# EAGLE design mrShark LED-Marker (EAGLE 7.2.0)
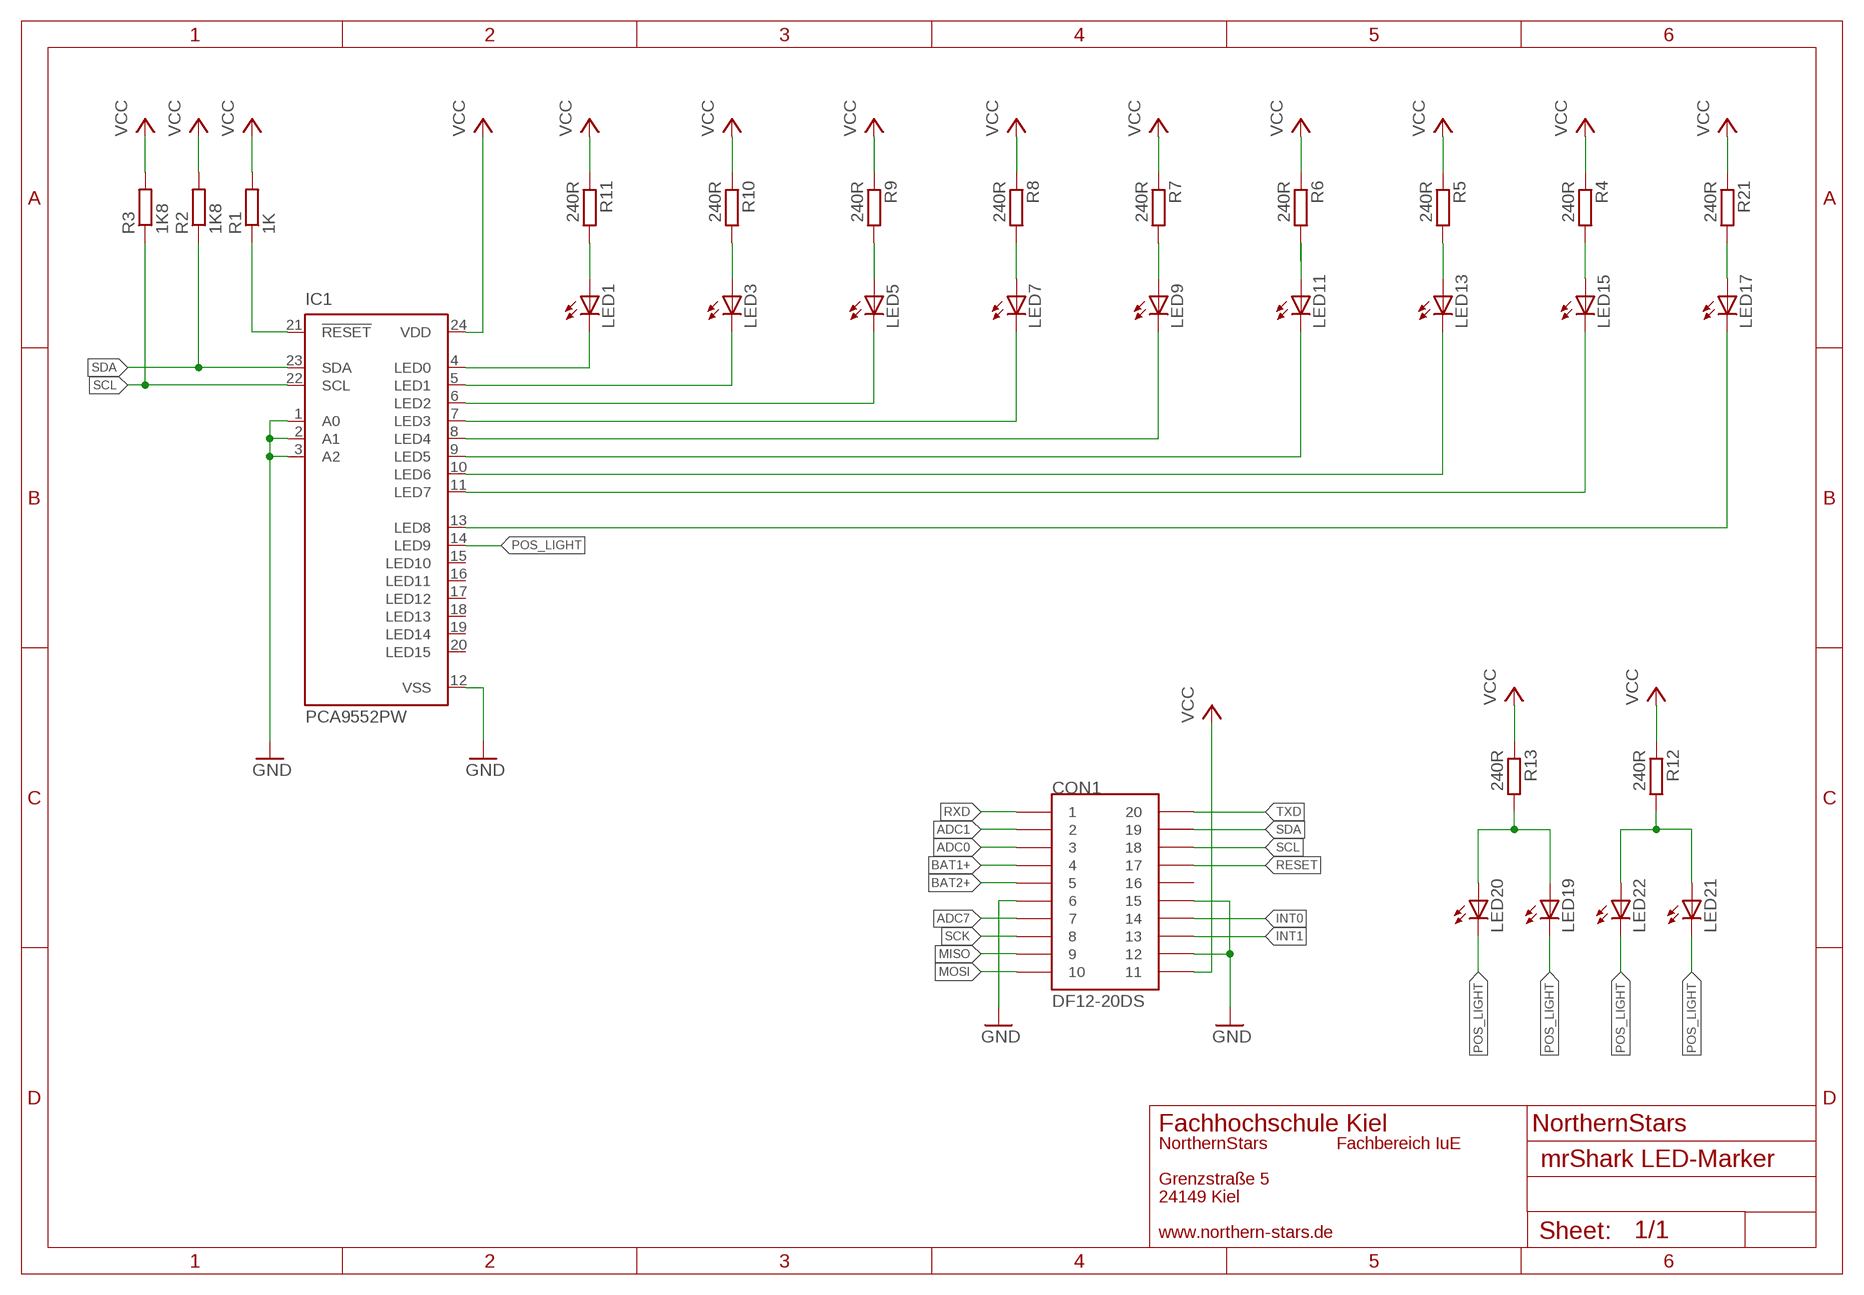
[diagram p0: schematic, sheet 1]

## Parts
CON1  DF12-20DS  [DF12-20DS]
IC1  PCA9552PW  [TSSOP24]
LED1  LEDCHIPLED_0603  [CHIPLED_0603]
LED3  LEDCHIPLED_0603  [CHIPLED_0603]
LED5  LEDCHIPLED_0603  [CHIPLED_0603]
LED7  LEDCHIPLED_0603  [CHIPLED_0603]
LED9  LEDCHIPLED_0603  [CHIPLED_0603]
LED11  LEDCHIPLED_0603  [CHIPLED_0603]
LED13  LEDCHIPLED_0603  [CHIPLED_0603]
LED15  LEDCHIPLED_0603  [CHIPLED_0603]
LED17  LEDCHIPLED_0603  [CHIPLED_0603]
LED19  LEDCHIPLED_0603  [CHIPLED_0603]
LED20  LEDCHIPLED_0603  [CHIPLED_0603]
LED21  LEDCHIPLED_0603  [CHIPLED_0603]
LED22  LEDCHIPLED_0603  [CHIPLED_0603]
R1  1K  R-EU_R0603  [R0603]
R2  1K8  R-EU_R0603  [R0603]
R3  1K8  R-EU_R0603  [R0603]
R4  240R  R-EU_R0603  [R0603]
R5  240R  R-EU_R0603  [R0603]
R6  240R  R-EU_R0603  [R0603]
R7  240R  R-EU_R0603  [R0603]
R8  240R  R-EU_R0603  [R0603]
R9  240R  R-EU_R0603  [R0603]
R10  240R  R-EU_R0603  [R0603]
R11  240R  R-EU_R0603  [R0603]
R12  240R  R-EU_R0603  [R0603]
R13  240R  R-EU_R0603  [R0603]
R21  240R  R-EU_R0603  [R0603]

## Nets
ADC0: CON1.3
ADC1: CON1.2
ADC7: CON1.7
BAT1+: CON1.4
BAT2+: CON1.5
GND: CON1.6 CON1.12 CON1.15 IC1.1(A0) IC1.2(A1) IC1.3(A2) IC1.12(VSS)
INT0: CON1.14
INT1: CON1.13
MISO: CON1.9
MOSI: CON1.10
N$1: IC1.21(!RESET) R1.1
N$2: LED17.A R21.2
N$3: LED21.A LED22.A R12.2
N$4: LED15.A R4.2
N$5: LED13.A R5.2
N$6: LED11.A R6.2
N$7: LED9.A R7.2
N$8: LED7.A R8.2
N$9: LED19.A LED20.A R13.2
N$10: LED5.A R9.2
N$11: LED3.A R10.2
N$12: LED1.A R11.2
N$13: IC1.4(LED0) LED1.C
N$14: IC1.5(LED1) LED3.C
N$15: IC1.6(LED2) LED5.C
N$16: IC1.7(LED3) LED7.C
N$17: IC1.8(LED4) LED9.C
N$18: IC1.9(LED5) LED11.C
N$19: IC1.10(LED6) LED13.C
N$20: IC1.11(LED7) LED15.C
N$21: IC1.13(LED8) LED17.C
POS_LIGHT: IC1.14(LED9) LED19.C LED20.C LED21.C LED22.C
RESET: CON1.17
RXD: CON1.1
SCK: CON1.8
SCL: CON1.18 IC1.22(SCL) R3.1
SDA: CON1.19 IC1.23(SDA) R2.1
TXD: CON1.20
VCC: CON1.11 IC1.24(VDD) R1.2 R2.2 R3.2 R4.1 R5.1 R6.1 R7.1 R8.1 R9.1 R10.1 R11.1 R12.1 R13.1 R21.1
Unconnected: CON1.16 IC1.15(LED10) IC1.16(LED11) IC1.17(LED12) IC1.18(LED13) IC1.19(LED14) IC1.20(LED15)

## Notes on the sheet
- Fachhochschule Kiel | NorthernStars
- NorthernStars | Fachbereich IuE
- Grenzstraße 5
- 24149 Kiel
- www.northern-stars.de

## Library data of the parts
CON1 = con-hirose:DF12-20: HRS-Hirose DF12-Series 0.5mm Pitch SMT Board to Board Connector 20 contacts
IC1 = micro-philips:PCA9552: 16-bit I 2 C-bus LED driver with programmable blink rates
LED1 LED3 LED5 LED7 LED9 LED11 LED13 LED15 LED17 LED19-LED22 = led:LED: LED OSRAM: - CHIPLED LG R971, LG N971, LY N971, LG Q971, LY Q971, LO R971, LY R971 LH N974, LH R974 LS Q976, LO Q976, LY Q976 LO Q996 - Hyper CHIPLED LW Q18S LB Q993, LB Q99A, LB R99A - SideLED LS A670, LO A670, LY A670, LG A670, LP A670 LB A673, LV A673, LT A673, LW A673 LH A674 LY A675 LS A676, LA A676, LO A676, LY A676, LW A676 LS A679, LY A679, LG A679 - Hyper Micro SIDELED® LS Y876, LA Y876, LO Y876, LY Y876 LT Y87S - SmartLED LW L88C, LW L88S LB L89C, LB L89S, LG L890 LS L89K, LO L89K, LY L89K LS L896, LA L896, LO L896, LY L896 - TOPLED LS T670, LO T670, LY T670, LG T670, LP T670 LSG T670, LSP T670, LSY T670, LOP T670, LYG T670 LG T671, LOG T671, LSG T671 LB T673, LV T673, LT T673, LW T673 LH T674 LS T676, LA T676, LO T676, LY T676, LB T676, LH T676, LSB T676, LW T676 LB T67C, LV T67C, LT T67C, LS T67K, LO T67K, LY T67K, LW E67C LS E67B, LA E67B, LO E67B, LY E67B, LB E67C, LV E67C, LT E67C LW T67C LS T679, LY T679, LG T679 LS T770, LO T770, LY T770, LG T770, LP T770 LB T773, LV T773, LT T773, LW T773 LH T774 LS E675, LA E675, LY E675, LS T675 LS T776, LA T776, LO T776, LY T776, LB T776 LHGB T686 LT T68C, LB T68C - Hyper Mini TOPLED® LB M676 - Mini TOPLED Santana® LG M470 LS M47K, LO M47K, LY M47K Source: http://www.osram.convergy.de LUXEON: - LUMILED® LXK2-PW12-R00, LXK2-PW12-S00, LXK2-PW14-U00, LXK2-PW14-V00 LXK2-PM12-R00, LXK2-PM12-S00, LXK2-PM14-U00 LXK2-PE12-Q00, LXK2-PE12-R00, LXK2-PE12-S00, LXK2-PE14-T00, LXK2-PE14-U00 LXK2-PB12-K00, LXK2-PB12-L00, LXK2-PB12-M00, LXK2-PB14-N00, LXK2-PB14-P00, LXK2-PB14-Q00 LXK2-PR12-L00, LXK2-PR12-M00, LXK2-PR14-Q00, LXK2-PR14-R00 LXK2-PD12-Q00, LXK2-PD12-R00, LXK2-PD12-S00 LXK2-PH12-R00, LXK2-PH12-S00 LXK2-PL12-P00, LXK2-PL12-Q00, LXK2-PL12-R00 Source: www.luxeon.com KINGBRIGHT: KA-3528ASYC Source: www.kingbright.com
R1-R13 R21 = rcl:R-EU_: RESISTOR, European symbol

## Board
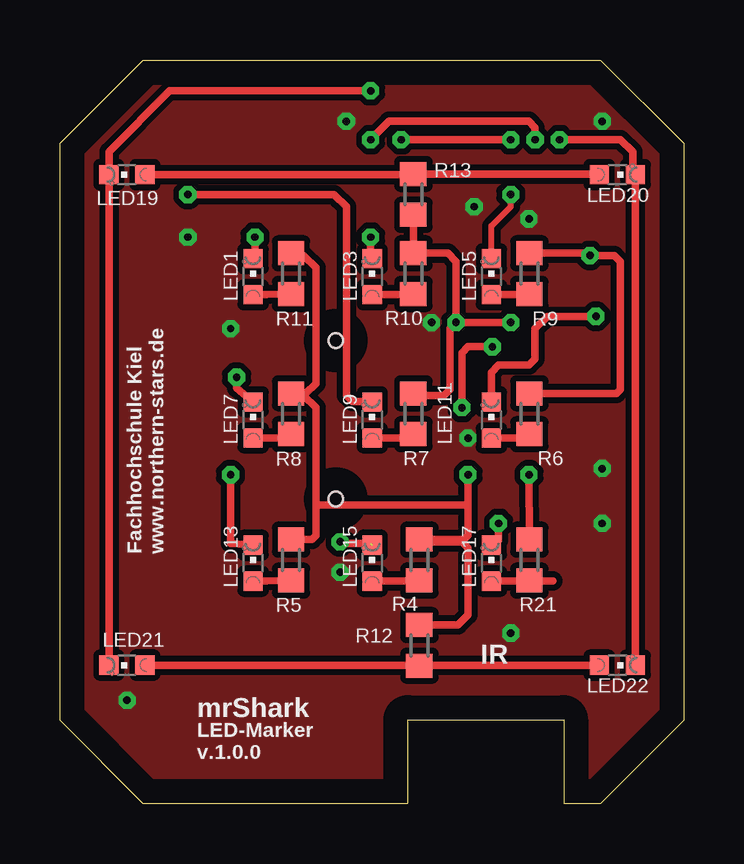
[diagram p1: board, top side]
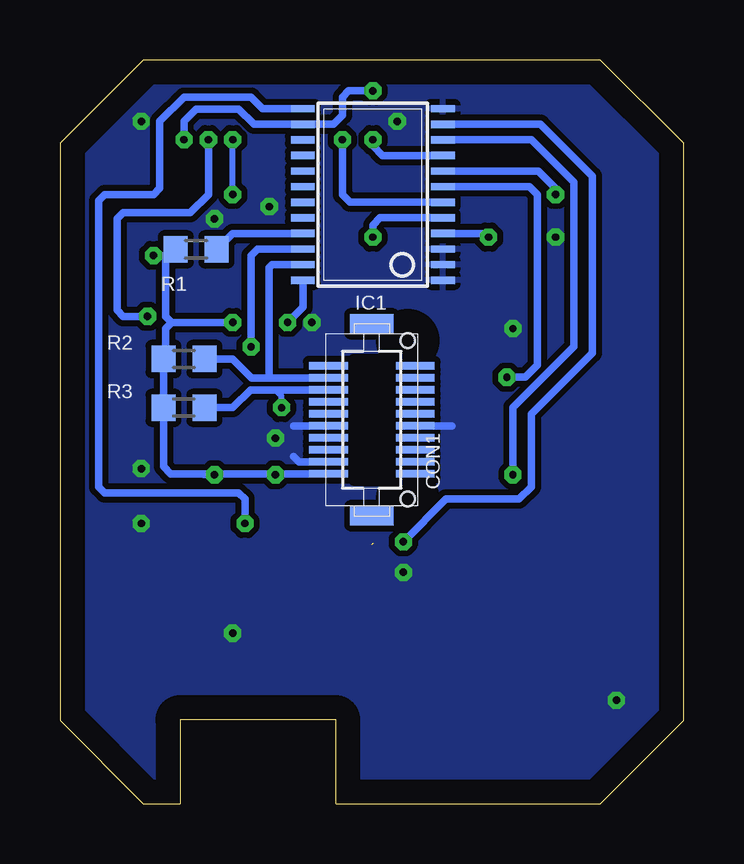
[diagram p2: board, bottom side, seen from below]

Size 26 x 31 mm. Coordinates in mm from the lower left corner, seen from the top.
Outline: 0,27.53 3.47,31 22.53,31 26,27.53 26,3.47 22.53,0 21,0 21,3.5 14.5,3.5 14.5,0 3.47,0 0,3.47 0,27.53
Copper layers (1*16): Top 0.035mm / dielectric 1.5mm / Bottom 0.035mm
Design rules "default": minimum track width 10mil, minimum drill 24mil, track to track 8mil, track to pad 8mil, pad to pad 8mil, via to via 8mil, smd to smd 8mil, copper to edge 40mil, drill to drill 8mil, minimum pad ring 10mil, minimum via ring 8mil, stop-mask expansion 4mil, vias tented up to drill 0mil, thermal gap 10mil

### Footprints (pad centres in the part's own frame; a part is rotated, then mirrored left to right if it is on the bottom)
DF12-20DS = smd 0.32 x 1.62: 1 -2.25,1.81; 2 -1.75,1.81; 3 -1.25,1.81; 4 -0.75,1.81; 5 -0.25,1.81; 6 0.25,1.81; 7 0.75,1.81; 8 1.25,1.81; 9 1.75,1.81; 10 2.25,1.81; 11 2.25,-1.81; 12 1.75,-1.81; 13 1.25,-1.81; 14 0.75,-1.81; 15 0.25,-1.81; 16 -0.25,-1.81; 17 -0.75,-1.81; 18 -1.25,-1.81; 19 -1.75,-1.81; 20 -2.25,-1.81 | smd 0.8 x 1.8: T1 -4,0; T2 4,0 | hole 0.6: -3.3,1.5; 3.3,1.5
TSSOP24 = smd 0.305 x 0.991: 1 -3.575,-2.918; 2 -2.925,-2.918; 3 -2.275,-2.918; 4 -1.625,-2.918; 5 -0.975,-2.918; 6 -0.325,-2.918; 7 0.325,-2.918; 8 0.975,-2.918; 9 1.625,-2.918; 10 2.275,-2.918; 11 2.925,-2.918; 12 3.575,-2.918; 13 3.575,2.918; 14 2.925,2.918; 15 2.275,2.918; 16 1.625,2.918; 17 0.975,2.918; 18 0.325,2.918; 19 -0.325,2.918; 20 -0.975,2.918; 21 -1.625,2.918; 22 -2.275,2.918; 23 -2.925,2.918; 24 -3.575,2.918
CHIPLED_0603 = smd 0.8 x 0.8: A 0,-0.75; C 0,0.75
R0603 = smd 1 x 1.1: 1 -0.85,0; 2 0.85,0

### Placement (x,y rotation side)
CON1  13,16 270 bottom
IC1  12.95,25.39 90 bottom
LED1  8.05,21.96 0 top
LED3  13.02,21.96 0 top
LED5  17.99,21.96 0 top
LED7  8.05,15.99 0 top
LED9  13.02,15.99 0 top
LED11  17.99,15.99 0 top
LED13  8.05,10.03 0 top
LED15  13.02,10.03 0 top
LED17  17.99,10.03 0 top
LED19  2.79,26.22 90 top
LED20  23.24,26.22 270 top
LED21  2.79,5.77 90 top
LED22  23.24,5.77 270 top
R1  20.32,23.11 180 bottom
R2  20.83,18.53 180 bottom
R3  20.83,16.5 180 bottom
R4  14.99,10.15 270 top
R5  9.64,10.15 270 top
R6  19.57,16.25 270 top
R7  14.73,16.25 270 top
R8  9.64,16.25 270 top
R9  19.57,22.09 270 top
R10  14.73,22.09 270 top
R11  9.64,22.09 270 top
R12  14.99,6.6 270 top
R13  14.73,25.39 90 top
R21  19.57,10.15 270 top

### Tracks (layer width: path | path; a pad name or v marks a point on that pad's centre or on a via)
GND  (via drill 0.3)
  Bottom 0.305: CON1.15 16.25,15.75 16.26,15.74 | CON1.12 16.04,14.25 16.26,14.47 | CON1.6 9.66,15.75 9.65,15.74
  other vias: 7.11,19.8 11.94,28.44 11.68,9.64 17.02,15.23 2.79,4.31 22.61,11.68 5.33,23.61 17.27,24.88 19.56,24.38 15.49,20.06 18.8,7.1 22.61,13.96 22.61,28.44
  pour Top (isolate 0.254): 0,-0.01 0,31.23 26.16,31.23 26.16,-0.01
  pour Bottom (isolate 0.254): 0,-0.01 0,31.23 26.16,31.23 26.16,-0.01
N$1
  Bottom 0.305: IC1.21 18.81,23.77 R1.1
N$2
  Top 0.305: LED17.A 20.55,9.28 R21.2
N$3
  Top 0.305: LED21.A 14.96,5.77 R12.2 15.01,5.77 LED22.A
N$4
  Top 0.305: LED15.A 14.96,9.28 R4.2
N$5
  Top 0.305: LED13.A 8.61,9.28 R5.2
N$6
  Top 0.305: LED11.A 19.57,15.24 R6.2
N$7
  Top 0.305: LED9.A 14.58,15.24 R7.2
N$8
  Top 0.305: LED7.A 9.5,15.24 R8.2
N$9
  Top 0.305: LED19.A 14.71,26.22 R13.2 22.47,26.24 LED20.A
N$10
  Top 0.305: LED5.A 19.28,21.21 R9.2
N$11
  Top 0.305: LED3.A 14.71,21.21 R10.2
N$12
  Top 0.305: LED1.A 8.61,21.21 R11.2
N$13  (via drill 0.3)
  Top 0.305: v8.13,23.61 8.13,22.78 LED1.C
  Bottom 0.305: IC1.4 8.28,23.77 v8.13,23.61
N$14  (via drill 0.3)
  Top 0.305: v12.95,23.61 12.95,22.78 LED3.C
  Bottom 0.305: IC1.5 12.66,24.42 12.95,24.12 v12.95,23.61
N$15  (via drill 0.3)
  Top 0.254: LED5.C 17.99,24.07 18.8,24.88 v18.8,25.39
  Top 0.305: v14.22,27.68 v18.8,27.68
  Bottom 0.254: v18.8,25.39 v18.8,27.68
  Bottom 0.305: IC1.6 13.9,25.07 14.22,25.39 v14.22,27.68
N$16  (via drill 0.3)
  Top 0.305: v7.37,17.77 7.37,17.32 LED7.C
  Bottom 0.305: IC1.7 6.42,25.72 6.1,25.39 6.1,18.28 6.6,17.77 v7.37,17.77
N$17  (via drill 0.3)
  Top 0.305: v5.33,25.39 11.43,25.39 11.94,24.88 11.94,17.01 12.19,16.76 13.01,16.76 LED9.C
  Bottom 0.305: IC1.8 6.05,26.37 5.33,25.65 v5.33,25.39
N$18  (via drill 0.3)
  Top 0.305: v19.81,27.68 19.81,28.19 19.56,28.44 13.72,28.44 v12.95,27.68 | v22.35,20.31 20.32,20.31 19.81,19.8 19.81,18.53 19.56,18.28 18.29,18.28 17.99,17.98 LED11.C
  Bottom 0.305: IC1.9 12.55,27.02 12.95,27.42 v12.95,27.68 | v19.81,27.68 19.81,25.39 20.57,24.63 23.37,24.63 23.62,24.38 23.62,20.57 23.37,20.31 v22.35,20.31
N$19  (via drill 0.3)
  Top 0.305: v7.11,13.71 7.11,10.84 LED13.C
  Bottom 0.305: IC1.10 6.34,27.67 4.57,25.9 4.57,19.04 7.11,16.5 v7.11,13.71
N$20  (via drill 0.3)  (1 unrouted)
  Top 0.305: 12.95,10.84 11.76,10.84 v11.68,10.91
  Bottom 0.305: IC1.11 5.97,28.32 3.81,26.15 3.81,18.79 6.35,16.25 6.35,13.2 6.86,12.69 9.91,12.69 v11.68,10.91
N$21  (via drill 0.3)
  Top 0.305: v18.29,11.68 18.29,10.97 LED17.C
  Bottom 0.305: IC1.13 17.55,28.97 18.03,29.46 20.83,29.46 21.84,28.44 21.84,25.65 22.1,25.39 24.13,25.39 24.38,25.14 24.38,13.2 24.13,12.95 18.54,12.95 18.29,12.69 v18.29,11.68
POS_LIGHT  (via drill 0.3)
  Top 0.305: LED21.C LED19.C 2.04,27.18 4.57,29.71 v12.95,29.71 | LED22.C LED20.C 23.88,26.33 23.88,27.17 23.37,27.68 v20.83,27.68
  Bottom 0.305: v20.83,27.68 20.83,28.44 20.32,28.95 18.54,28.95 17.91,28.32 IC1.14 14.6,28.32 14.22,28.69 14.22,29.46 13.97,29.71 v12.95,29.71
SCL  (via drill 0.3)
  Top 0.305: v18.03,19.04 17.02,19.04 16.76,18.79 v16.76,16.5
  Bottom 0.254: v16.76,16.5 16.76,17 17.02,17.25
  Bottom 0.305: CON1.18 17.02,17.25 18.05,17.25 18.8,16.5 R3.1 | IC1.22 17.77,23.12 18.03,22.85 v18.03,19.04
SDA
  Bottom 0.305: CON1.19 17.27,17.75 | 17.27,17.75 18.01,17.75 18.8,18.53 R2.1 | IC1.23 17.15,22.47 17.27,22.34 17.27,17.75
VCC  (via drill 0.3)
  Top 0.305: v16.51,20.06 v18.8,20.06 | R6.1 23.2,17.1 23.37,17.26 23.37,22.6 23.11,22.85 v22.1,22.85 22.01,22.94 R9.1 | R13.1 R10.1 16.17,22.94 16.51,22.6 v16.51,20.06 | R21.1 v19.56,13.71 | R12.1 16.6,7.45 17.02,7.87 17.02,10.66 16.76,10.91 15.07,10.91 R4.1 16.85,11 17.02,11.17 17.02,12.44 | 17.02,12.44 v17.02,13.71 | R5.1 10.5,11 10.67,11.17 10.67,12.44 | 10.67,12.44 17.02,12.44 | 10.67,12.44 10.67,16.5 10.16,17.01 9.74,17.01 R8.1 10.25,17.1 10.67,17.52 10.67,22.34 10.16,22.85 9.74,22.85 R11.1 | R7.1 14.82,17.01 16,17.01 16.26,17.26 16.26,19.8 v16.51,20.06
  Bottom 0.305: IC1.24 15.87,20.7 v16.51,20.06 | v18.8,20.06 21.34,20.06 | 21.34,20.06 21.59,19.8 21.59,18.62 R2.2 R3.2 21.68,14.05 21.38,13.75 20.57,13.75 | R1.2 21.34,23.11 21.59,22.85 | 21.59,22.85 21.59,20.31 21.34,20.06 | 21.59,22.85 v22.1,22.85 | CON1.11 17.02,13.75 | 17.02,13.75 20.57,13.75 | v19.56,13.71 20.57,13.75 | v17.02,13.71 17.02,13.75

### Text on the board
tNames: Fachhochschule Kiel / www.northern-stars.de | IR | mrShark | LED-Marker / v.1.0.0